# Altium schematic sheet VNA_8.SchDoc: VNA
size 409 x 289 mm; Origin: Eagle; OriginPath: C:\Users\Ground Lab\Desktop\LibreVNA\Hardware\Eagle\VNA.sch; OriginSheet: 9; Date: 04.05.2025 20:03:37; SheetNumber: 9; GateName_1: G$1; SymbolName_1: A3L-LOC; LibraryName: VNA; DeviceSetName: A3L-LOC; Sheet: Sheet:
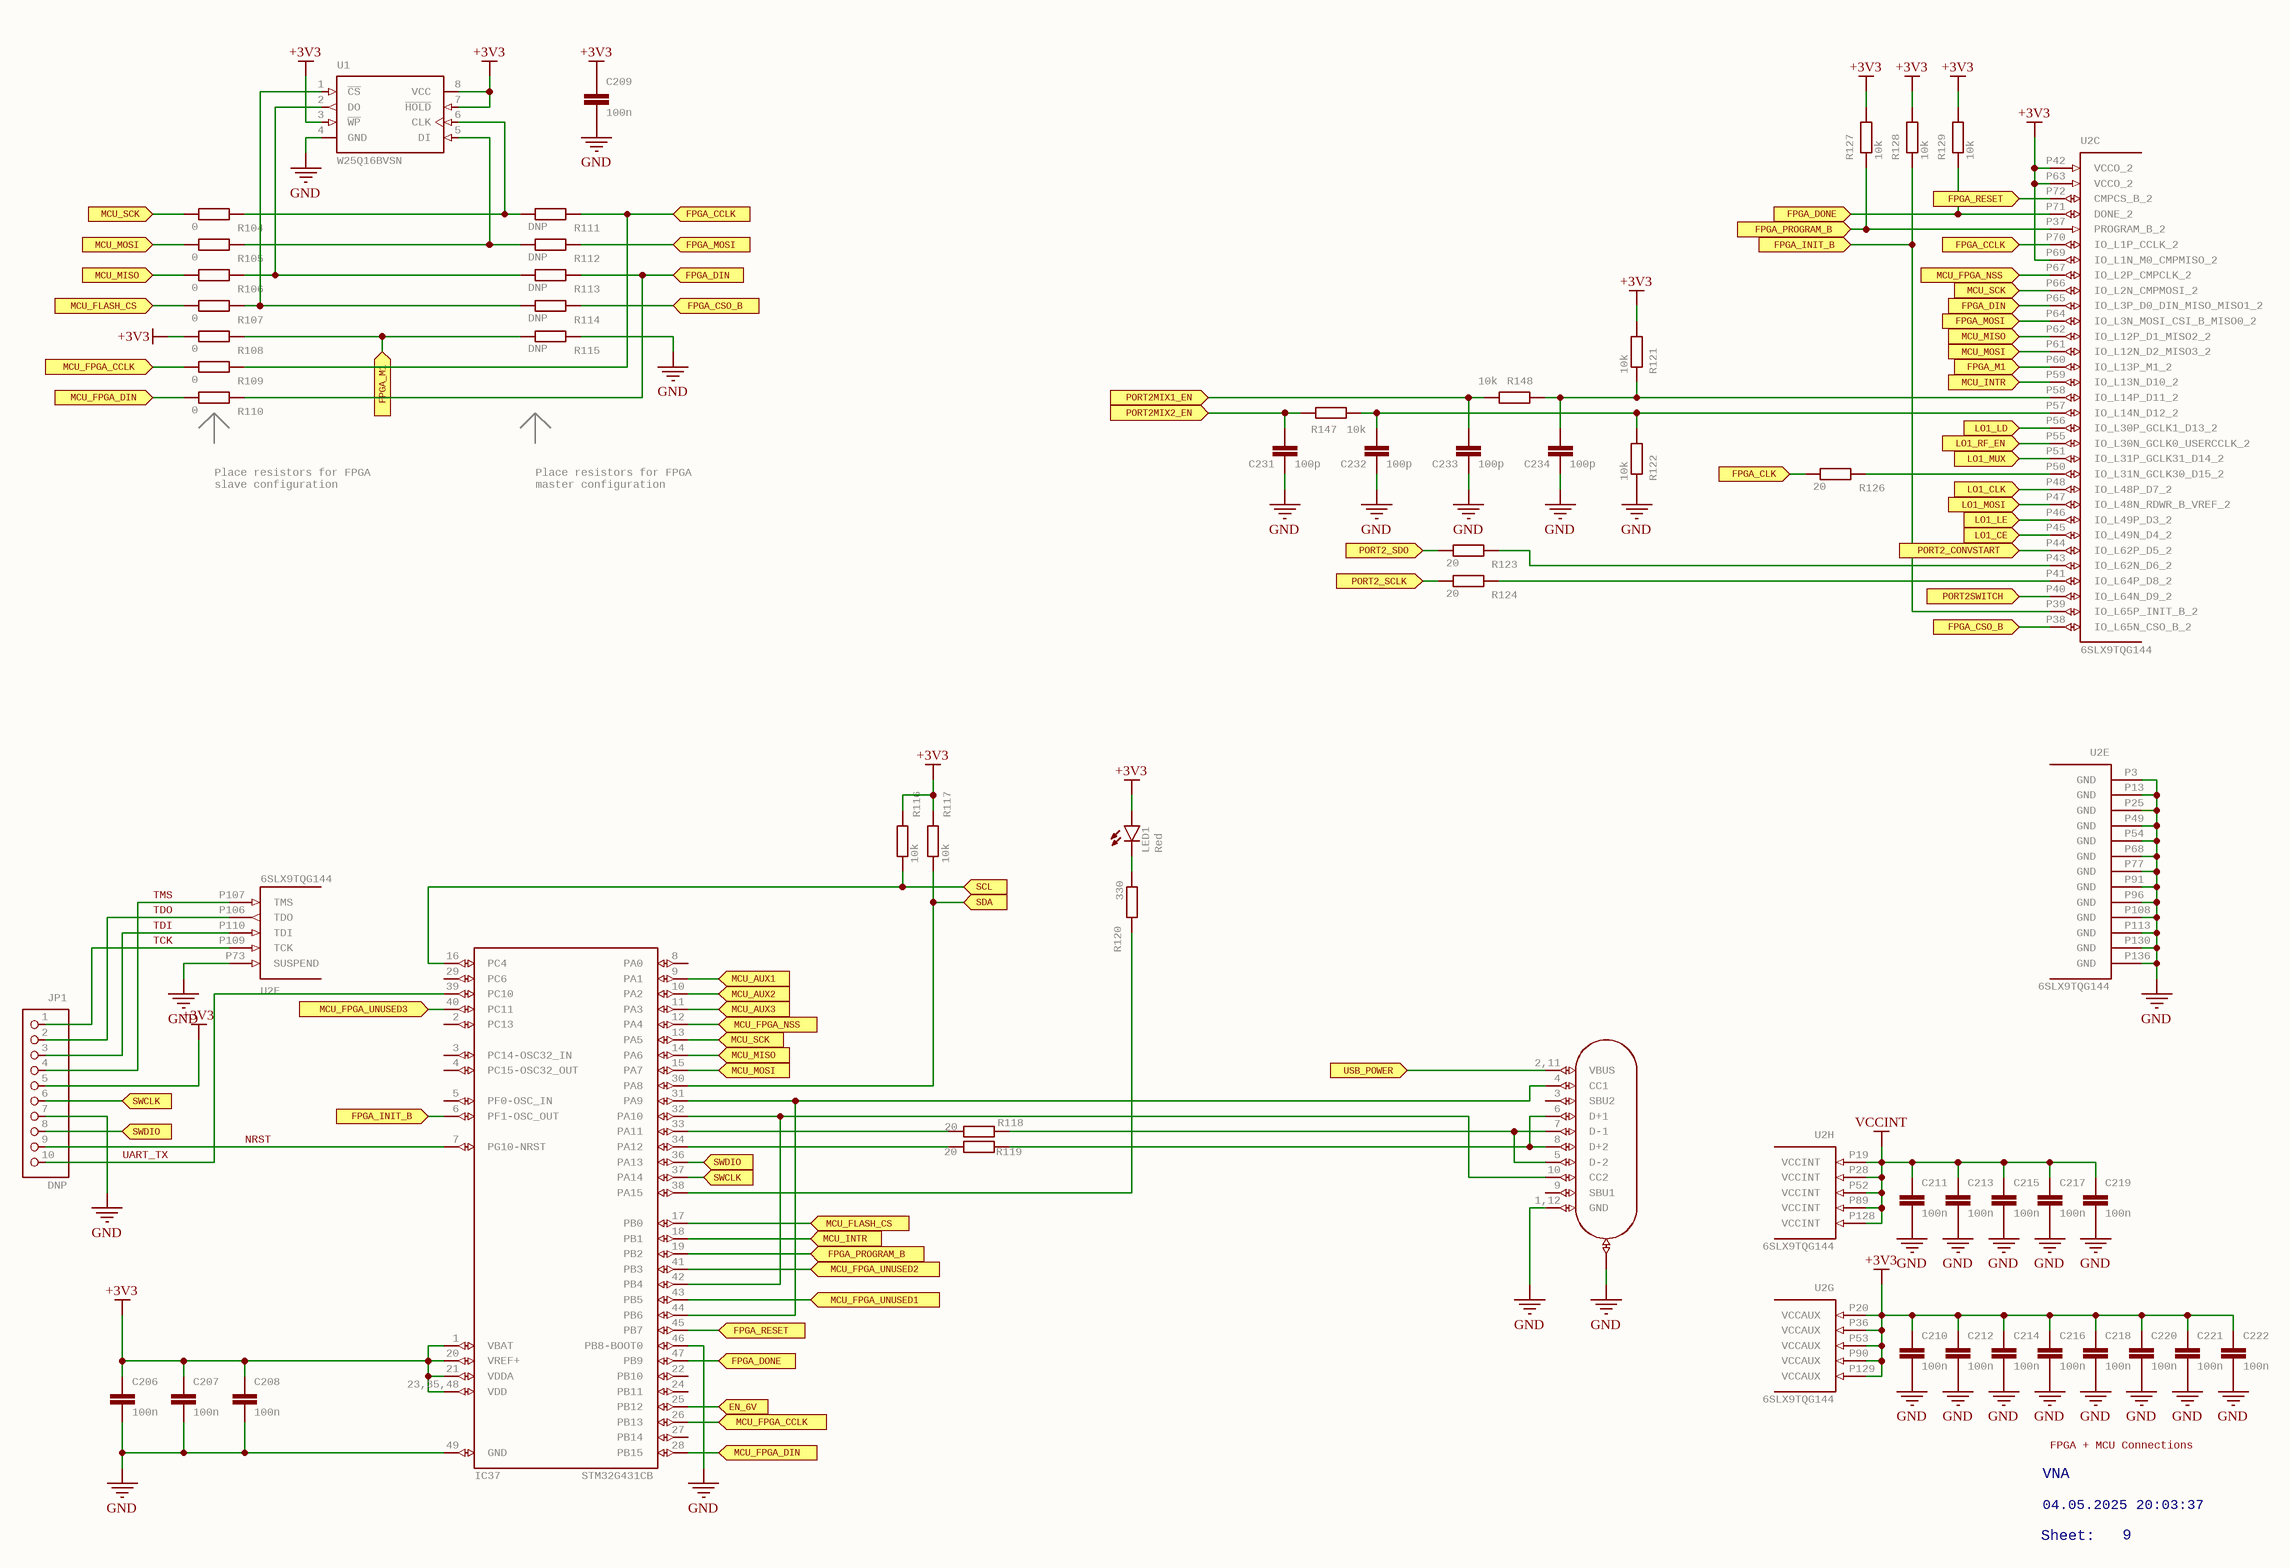
[diagram p0: VNA_8.SchDoc]

## Parts
C206  100n  [C0402]
C207  100n  [C0402]
C208  100n  [C0402]
C209  100n  [C0402]
C210  100n  [C0402]
C211  100n  [C0402]
C212  100n  [C0402]
C213  100n  [C0402]
C214  100n  [C0402]
C215  100n  [C0402]
C216  100n  [C0402]
C217  100n  [C0402]
C218  100n  [C0402]
C219  100n  [C0402]
C220  100n  [C0402]
C221  100n  [C0402]
C222  100n  [C0402]
C231  100p  [C0402]
C232  100p  [C0402]
C233  100p  [C0402]
C234  100p  [C0402]
IC37  STM32G431CB  [QFN50P700X700X60-49T560N]
J4  TYPE-C16P(073)  [TYPE-C16P]  (value not drawn)
JP1  DNP  [1X10/90]
LED1  Red  [CHIPLED_0603]
R104  0  [R0402]
R105  0  [R0402]
R106  0  [R0402]
R107  0  [R0402]
R108  0  [R0402]
R109  0  [R0402]
R110  0  [R0402]
R111  DNP  [R0402]
R112  DNP  [R0402]
R113  DNP  [R0402]
R114  DNP  [R0402]
R115  DNP  [R0402]
R116  10k  [R0402]
R117  10k  [R0402]
R118  20  [R0402]
R119  20  [R0402]
R120  330  [R0402]
R121  10k  [R0402]
R122  10k  [R0402]
R123  20  [R0402]
R124  20  [R0402]
R126  20  [R0402]
R127  10k  [R0402]
R128  10k  [R0402]
R129  10k  [R0402]
R147  10k  [R0402]
R148  10k  [R0402]
U1  W25Q16BVSN  [SO08]
U2  6SLX9TQG144  [TQ144]  (parts C,E,F,G,H of 8)

## Ports
EN_6V (in), FPGA_CCLK (in), FPGA_CLK (in), FPGA_CSO_B (in), FPGA_DIN (in), FPGA_DONE (in), FPGA_INIT_B (in), FPGA_M1 (in), FPGA_MOSI (in), FPGA_PROGRAM_B (in), FPGA_RESET (in), LO1_CE (in), LO1_CLK (in), LO1_LD (in), LO1_LE (in), LO1_MOSI (in), LO1_MUX (in), LO1_RF_EN (in), MCU_AUX1 (in), MCU_AUX2 (in), MCU_AUX3 (in), MCU_FLASH_CS (in), MCU_FPGA_CCLK (in), MCU_FPGA_DIN (in), MCU_FPGA_NSS (in), MCU_FPGA_UNUSED1 (in), MCU_FPGA_UNUSED2 (in), MCU_FPGA_UNUSED3 (in), MCU_INTR (in), MCU_MISO (in), MCU_MOSI (in), MCU_SCK (in), PORT2_CONVSTART (in), PORT2_SCLK (in), PORT2_SDO (in), PORT2MIX1_EN (in), PORT2MIX2_EN (in), PORT2SWITCH (in), SCL (in), SDA (in), SWCLK (in), SWDIO (in), USB_POWER (in)

## Nets
+3V3: C206.1 C207.1 C208.1 C209.1 C210.1 C212.1 C214.1 C216.1 C218.1 C220.1 C221.1 C222.1 IC37.1(VBAT) IC37.20(VREF+) IC37.21(VDDA) IC37.23,35,48(VDD) JP1.5 LED1.A R108.1 R116.2 R117.2 R121.2 R127.2 R128.2 R129.2 U1.3(~{WP}) U1.7(~{HOLD}) U1.8(VCC) U2.P20(VCCAUX) U2.P36(VCCAUX) U2.P42(VCCO_2) U2.P53(VCCAUX) U2.P63(VCCO_2) U2.P69(IO_L1N_M0_CMPMISO_2) U2.P90(VCCAUX) U2.P129(VCCAUX)
GND: C206.2 C207.2 C208.2 C209.2 C210.2 C211.2 C212.2 C213.2 C214.2 C215.2 C216.2 C217.2 C218.2 C219.2 C220.2 C221.2 C222.2 C231.2 C232.2 C233.2 C234.2 IC37.46(PB8-BOOT0) IC37.49(GND) J4.1,12(GND) J4.M1-4(CASE) JP1.7 R115.2 R122.1 U1.4(GND) U2.P3(GND) U2.P13(GND) U2.P25(GND) U2.P49(GND) U2.P54(GND) U2.P68(GND) U2.P73(SUSPEND) U2.P77(GND) U2.P91(GND) U2.P96(GND) U2.P108(GND) U2.P113(GND) U2.P130(GND) U2.P136(GND)
VCCINT: C211.1 C213.1 C215.1 C217.1 C219.1 U2.P19(VCCINT) U2.P28(VCCINT) U2.P52(VCCINT) U2.P89(VCCINT) U2.P128(VCCINT)
EN_6V: IC37.25(PB12) ; port EN_6V
FPGA_CCLK: R109.2 R111.2 U2.P70(IO_L1P_CCLK_2) ; port FPGA_CCLK
FPGA_CLK: R126.1 ; port FPGA_CLK
FPGA_CSO_B: R114.2 U2.P38(IO_L65N_CSO_B_2) ; port FPGA_CSO_B
FPGA_DIN: R110.2 R113.2 U2.P65(IO_L3P_D0_DIN_MISO_MISO1_2) ; port FPGA_DIN
FPGA_DONE: IC37.47(PB9) R129.1 U2.P71(DONE_2) ; port FPGA_DONE
FPGA_INIT_B: IC37.6(PF1-OSC_OUT) R128.1 U2.P39(IO_L65P_INIT_B_2) ; port FPGA_INIT_B
FPGA_M1: R108.2 R115.1 U2.P60(IO_L13P_M1_2) ; port FPGA_M1
FPGA_MOSI: R112.2 U2.P64(IO_L3N_MOSI_CSI_B_MISO0_2) ; port FPGA_MOSI
FPGA_PROGRAM_B: IC37.19(PB2) R127.1 U2.P37(PROGRAM_B_2) ; port FPGA_PROGRAM_B
FPGA_RESET: IC37.45(PB7) U2.P72(CMPCS_B_2) ; port FPGA_RESET
LO1_CE: U2.P45(IO_L49N_D4_2) ; port LO1_CE
LO1_CLK: U2.P48(IO_L48P_D7_2) ; port LO1_CLK
LO1_LD: U2.P56(IO_L30P_GCLK1_D13_2) ; port LO1_LD
LO1_LE: U2.P46(IO_L49P_D3_2) ; port LO1_LE
LO1_MOSI: U2.P47(IO_L48N_RDWR_B_VREF_2) ; port LO1_MOSI
LO1_MUX: U2.P51(IO_L31P_GCLK31_D14_2) ; port LO1_MUX
LO1_RF_EN: U2.P55(IO_L30N_GCLK0_USERCCLK_2) ; port LO1_RF_EN
MCU_AUX1: IC37.9(PA1) ; port MCU_AUX1
MCU_AUX2: IC37.10(PA2) ; port MCU_AUX2
MCU_AUX3: IC37.11(PA3) ; port MCU_AUX3
MCU_FLASH_CS: IC37.17(PB0) R107.1 ; port MCU_FLASH_CS
MCU_FPGA_CCLK: IC37.26(PB13) R109.1 ; port MCU_FPGA_CCLK
MCU_FPGA_DIN: IC37.28(PB15) R110.1 ; port MCU_FPGA_DIN
MCU_FPGA_NSS: IC37.12(PA4) U2.P67(IO_L2P_CMPCLK_2) ; port MCU_FPGA_NSS
MCU_FPGA_UNUSED1: IC37.43(PB5) ; port MCU_FPGA_UNUSED1
MCU_FPGA_UNUSED2: IC37.41(PB3) ; port MCU_FPGA_UNUSED2
MCU_FPGA_UNUSED3: IC37.40(PC11) ; port MCU_FPGA_UNUSED3
MCU_INTR: IC37.18(PB1) U2.P59(IO_L13N_D10_2) ; port MCU_INTR
MCU_MISO: IC37.14(PA6) R106.1 U2.P62(IO_L12P_D1_MISO2_2) ; port MCU_MISO
MCU_MOSI: IC37.15(PA7) R105.1 U2.P61(IO_L12N_D2_MISO3_2) ; port MCU_MOSI
MCU_SCK: IC37.13(PA5) R104.1 U2.P66(IO_L2N_CMPMOSI_2) ; port MCU_SCK
NRST: IC37.7(PG10-NRST) JP1.9
PORT2_CONVSTART: U2.P44(IO_L62P_D5_2) ; port PORT2_CONVSTART
PORT2_SCLK: R124.1 ; port PORT2_SCLK
PORT2_SDO: R123.1 ; port PORT2_SDO
PORT2MIX1_EN: C233.1 R148.1 ; port PORT2MIX1_EN
PORT2MIX2_EN: C231.1 R147.2 ; port PORT2MIX2_EN
PORT2SWITCH: U2.P40(IO_L64N_D9_2) ; port PORT2SWITCH
SCL: IC37.16(PC4) R116.1 ; port SCL
SDA: IC37.30(PA8) R117.1 ; port SDA
SWCLK: IC37.37(PA14) JP1.6 ; port SWCLK
SWDIO: IC37.36(PA13) JP1.8 ; port SWDIO
TCK: JP1.1 U2.P109(TCK)
TDI: JP1.3 U2.P110(TDI)
TDO: JP1.2 U2.P106(TDO)
TMS: JP1.4 U2.P107(TMS)
UART_TX: IC37.39(PC10) JP1.10
USB_POWER: J4.2,11(VBUS) ; port USB_POWER
NetC232_1: C232.1 R122.2 R147.1 U2.P57(IO_L14N_D12_2)
NetC234_1: C234.1 R121.1 R148.2 U2.P58(IO_L14P_D11_2)
NetIC37_31: IC37.31(PA9) IC37.44(PB6) J4.4(CC1)
NetIC37_32: IC37.32(PA10) IC37.42(PB4) J4.10(CC2)
NetIC37_33: IC37.33(PA11) R118.2
NetIC37_34: IC37.34(PA12) R119.1
NetIC37_38: IC37.38(PA15) R120.2
NetJ4_5: J4.5(D-2) J4.6(D+1) J4.7(D-1) J4.8(D+2) R118.1 R119.2
NetLED1_C: LED1.C R120.1
NetR104_2: R104.2 R111.1 U1.6(CLK)
NetR105_2: R105.2 R112.1 U1.5(DI)
NetR106_2: R106.2 R113.1 U1.2(DO)
NetR107_2: R107.2 R114.1 U1.1(~{CS})
NetR123_2: R123.2 U2.P43(IO_L62N_D6_2)
NetR124_2: R124.2 U2.P41(IO_L64P_D8_2)
NetR126_2: R126.2 U2.P50(IO_L31N_GCLK30_D15_2)

Not connected (* = marked no-connect by the designer): IC37 2(PC13) 3(PC14-OSC32_IN) 4(PC15-OSC32_OUT) 5(PF0-OSC_IN) 8(PA0) 22(PB10) 24(PB11) 27(PB14) 29(PC6); J4 3(SBU2) 9(SBU1)

## Notes on the sheet
- Place resistors for FPGA
  slave configuration
- Place resistors for FPGA
  master configuration
- VNA
- FPGA + MCU Connections
- Sheet:
- 04.05.2025 20:03:37
- 9

## Library data of the parts
C206-C222 C231-C234 = C-EU*?:2C0402: CAPACITOR, European symbol; GateName_1: G$1; SymbolName_1: C-EU:1; DeviceName: C0402; LibraryName: VNA; DeviceSetName: C-EU*?:2
IC37 = STM32G431CB: GateName_1: G$1; SymbolName_1: STM32G431CB; LibraryName: VNA; DeviceSetName: STM32G431CB
J4 = TYPE-C16P(073): GateName_1: G$1; SymbolName_1: USB-C; LibraryName: VNA; DeviceSetName: TYPE-C16P(073)
JP1 = PINHD-1X10/90: PIN HEADER; GateName_1: A; SymbolName_1: PINHD10; DeviceName: /90; LibraryName: VNA; DeviceSetName: PINHD-1X10
LED1 = LEDCHIPLED_0603: LED   OSRAM: - CHIPLED LG R971, LG N971, LY N971, LG Q971, LY Q971, LO R971, LY R971 LH N974, LH R974 LS Q976, LO Q976, LY Q976 LO Q996 - Hyper CHIPLED LW Q18S LB Q993, LB Q99A, LB R99A - SideLED LS A670, LO A670, LY A670, LG A670, LP A670 LB A673, LV A673, LT A673, LW A673 LH A674 LY A675 LS A676, LA A676, LO A676, LY A676, LW A676 LS A679, LY A679, LG A679 -  Hyper Micro SIDELEDÂ® LS Y876, LA Y876, LO Y876, LY Y876 LT Y87S - SmartLED LW L88C, LW L88S LB L89C, LB L89S, LG L890 LS L89K, LO L89K, LY L89K LS L896, LA L896, LO L896, LY L896 - TOPLED LS T670, LO T670, LY T670, LG T670, LP T670 LSG T670, LSP T670, LSY T670, LOP T670, LYG T670 LG T671, LOG T671, LSG T671 LB T673, LV T673, LT T673, LW T673 LH T674 LS T676, LA T676, LO T676, LY T676, LB T676, LH T676, LSB T676, LW T676 LB T67C, LV T67C, LT T67C, LS T67K, LO T67K, LY T67K, LW E67C LS E67B, LA E67B, LO E67B, LY E67B, LB E67C, LV E67C, LT E67C LW T67C LS T679, LY T679, LG T679 LS T770, LO T770, LY T770, LG T770, LP T770 LB T773, LV T773, LT T773, LW T773 LH T774 LS E675, LA E675, LY E675, LS T675 LS T776, LA T776, LO T776, LY T776, LB T776 LHGB T686 LT T68C, LB T68C - Hyper Mini TOPLEDÂ® LB M676 - Mini TOPLED SantanaÂ® LG M470 LS M47K, LO M47K, LY M47K    Source: http://www.osram.convergy.de   LUXEON: - LUMILEDÂ® LXK2-PW12-R00, LXK2-PW12-S00, LXK2-PW14-U00, LXK2-PW14-V00 LXK2-PM12-R00, LXK2-PM12-S00, LXK2-PM14-U00 LXK2-PE12-Q00, LXK2-PE12-R00, LXK2-PE12-S00, LXK2-PE14-T00, LXK2-PE14-U00 LXK2-PB12-K00, LXK2-PB12-L00, LXK2-PB12-M00, LXK2-PB14-N00, LXK2-PB14-P00, LXK2-PB14-Q00 LXK2-PR12-L00, LXK2-PR12-M00, LXK2-PR14-Q00, LXK2-PR14-R00 LXK2-PD12-Q00, LXK2-PD12-R00, LXK2-PD12-S00 LXK2-PH12-R00, LXK2-PH12-S00 LXK2-PL12-P00, LXK2-PL12-Q00, LXK2-PL12-R00    Source: www.luxeon.com   KINGBRIGHT:   KA-3528ASYC Source: www.kingbright.com; GateName_1: G$1; POPULARITY: 0; SymbolName_1: LED; DeviceName: CHIPLED_0603; LibraryName: VNA; DeviceSetName: LED
R104-R124 R126-R129 R147 R148 = R-EU_R0402: RESISTOR, European symbol; GateName_1: G$1; SymbolName_1: R-EU; DeviceSetName: R-EU_; DeviceName: R0402; LibraryName: VNA
U1 = W25Q16BVSN: EEPROM   4 Mbit SPI Serial Flash7; GateName_1: G$1; SymbolName_1: 25XX; DeviceName: SN; LibraryName: VNA; DeviceSetName: W25Q16BV
U2 = 6SLX9TQG144: Xilinx FPGA: 6SLX9TQG144; GateName_1: B0; SymbolName_1: 6SLX9TQG144_0; GateName_2: B1; SymbolName_2: 6SLX9TQG144_1; GateName_3: B2; SymbolName_3: 6SLX9TQG144_2; GateName_4: B3; SymbolName_4: 6SLX9TQG144_3; GateName_5: BGND; SymbolName_5: 6SLX9TQG144_GND; GateName_6: BNA; SymbolName_6: 6SLX9TQG144_NA; GateName_7: BVCCAUX; SymbolName_7: 6SLX9TQG144_VCCAUX; GateName_8: BVCCINT; SymbolName_8: 6SLX9TQG144_VCCINT; LibraryName: VNA; DeviceSetName: 6SLX9TQG144